# EAGLE design untitled (EAGLE 6.3)
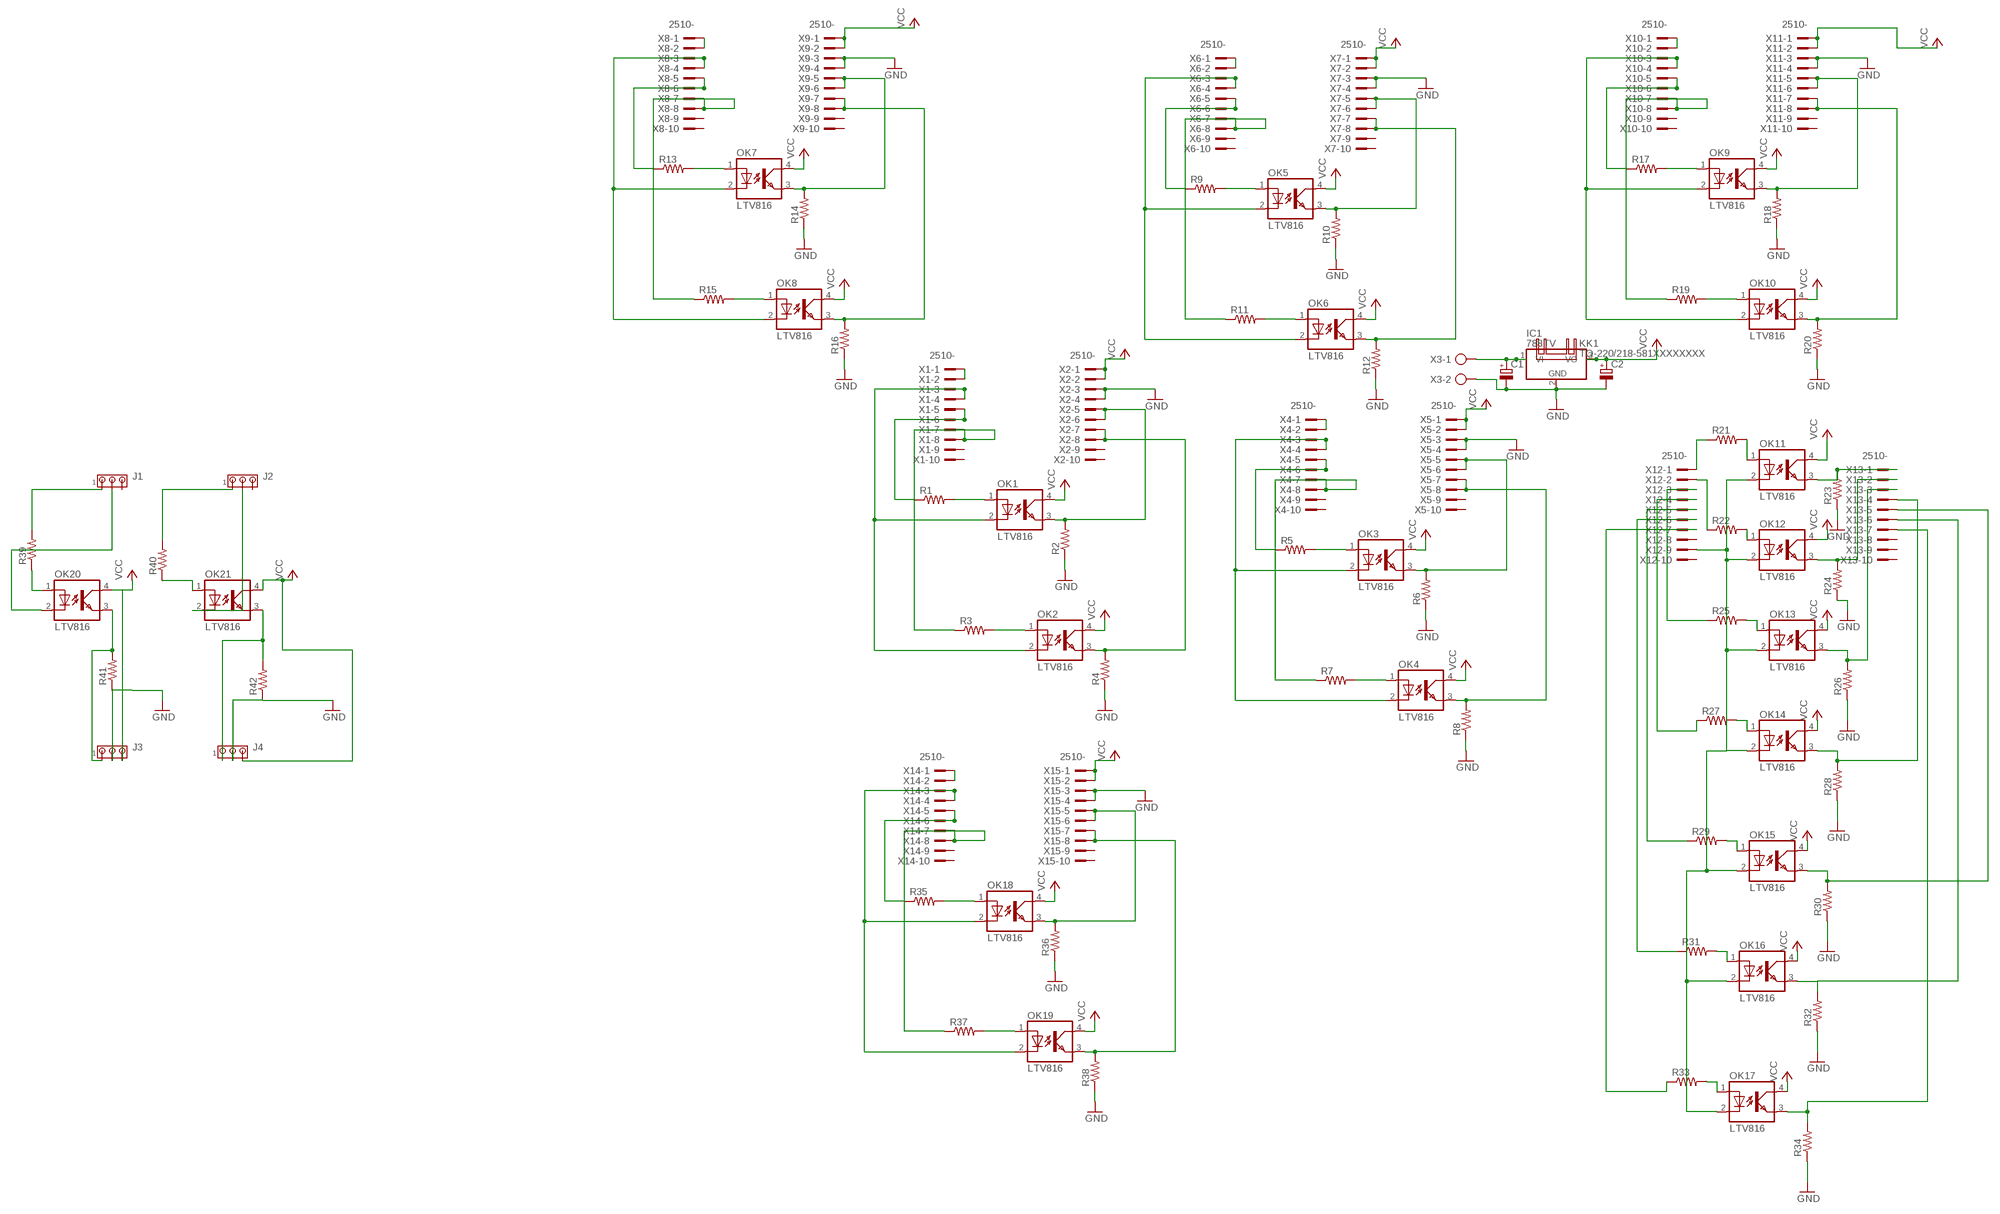
[diagram p0: schematic, sheet 1]

## Parts
C1  CPOL-EUE5-13  [E5-13]
C2  CPOL-EUE5-10.5  [E5-10,5]
IC1  788TV  [TO220V]
J1  MTA03-100  [10X03MTA]
J2  MTA03-100  [10X03MTA]
J3  MTA03-100  [10X03MTA]
J4  MTA03-100  [10X03MTA]
KK1  TO-220/218-581XXXXXXXX  [581XXXXXXXX]
OK1  LTV816  [DIL04]
OK2  LTV816  [DIL04]
OK3  LTV816  [DIL04]
OK4  LTV816  [DIL04]
OK5  LTV816  [DIL04]
OK6  LTV816  [DIL04]
OK7  LTV816  [DIL04]
OK8  LTV816  [DIL04]
OK9  LTV816  [DIL04]
OK10  LTV816  [DIL04]
OK11  LTV816  [DIL04]
OK12  LTV816  [DIL04]
OK13  LTV816  [DIL04]
OK14  LTV816  [DIL04]
OK15  LTV816  [DIL04]
OK16  LTV816  [DIL04]
OK17  LTV816  [DIL04]
OK18  LTV816  [DIL04]
OK19  LTV816  [DIL04]
OK20  LTV816  [DIL04]
OK21  LTV816  [DIL04]
R1  R-US_0207/10  [0207/10]
R2  R-US_0207/10  [0207/10]
R3  R-US_0207/10  [0207/10]
R4  R-US_0207/10  [0207/10]
R5  R-US_0207/10  [0207/10]
R6  R-US_0207/10  [0207/10]
R7  R-US_0207/10  [0207/10]
R8  R-US_0207/10  [0207/10]
R9  R-US_0207/10  [0207/10]
R10  R-US_0207/10  [0207/10]
R11  R-US_0207/10  [0207/10]
R12  R-US_0207/10  [0207/10]
R13  R-US_0207/10  [0207/10]
R14  R-US_0207/10  [0207/10]
R15  R-US_0207/10  [0207/10]
R16  R-US_0207/10  [0207/10]
R17  R-US_0207/10  [0207/10]
R18  R-US_0207/10  [0207/10]
R19  R-US_0207/10  [0207/10]
R20  R-US_0207/10  [0207/10]
R21  R-US_0207/10  [0207/10]
R22  R-US_0207/10  [0207/10]
R23  R-US_0207/10  [0207/10]
R24  R-US_0207/10  [0207/10]
R25  R-US_0207/10  [0207/10]
R26  R-US_0207/10  [0207/10]
R27  R-US_0207/10  [0207/10]
R28  R-US_0207/10  [0207/10]
R29  R-US_0207/10  [0207/10]
R30  R-US_0207/10  [0207/10]
R31  R-US_0207/10  [0207/10]
R32  R-US_0207/10  [0207/10]
R33  R-US_0207/10  [0207/10]
R34  R-US_0207/10  [0207/10]
R35  R-US_0207/10  [0207/10]
R36  R-US_0207/10  [0207/10]
R37  R-US_0207/10  [0207/10]
R38  R-US_0207/10  [0207/10]
R39  R-US_0207/10  [0207/10]
R40  R-US_0207/10  [0207/10]
R41  R-US_0207/10  [0207/10]
R42  R-US_0207/10  [0207/10]
X1  2510-  [PAK100/2500-10]
X2  2510-  [PAK100/2500-10]
X3  AK300/2  [AK300/2]
X4  2510-  [PAK100/2500-10]
X5  2510-  [PAK100/2500-10]
X6  2510-  [PAK100/2500-10]
X7  2510-  [PAK100/2500-10]
X8  2510-  [PAK100/2500-10]
X9  2510-  [PAK100/2500-10]
X10  2510-  [PAK100/2500-10]
X11  2510-  [PAK100/2500-10]
X12  2510-  [PAK100/2500-10]
X13  2510-  [PAK100/2500-10]
X14  2510-  [PAK100/2500-10]
X15  2510-  [PAK100/2500-10]

## Nets
GND: C1.- C2.- IC1.2(GND) J3.2 J4.2 R2.1 R4.1 R6.1 R8.1 R10.1 R12.1 R14.1 R16.1 R18.1 R20.1 R23.1 R24.1 R26.1 R28.1 R30.1 R32.1 R34.1 R36.1 R38.1 R41.1 R42.1 X2.3 X2.4 X3.2 X5.3 X5.4 X7.3 X7.4 X9.3 X9.4 X11.3 X11.4 X15.3 X15.4
N$1: X1.1 X1.2
N$2: X4.1 X4.2
N$3: R1.1 X1.5 X1.6
N$4: R5.1 X4.5 X4.6
N$5: C1.+ IC1.1(VI) X3.1
N$6: OK1.1(A) R1.2
N$7: OK3.1(A) R5.2
N$8: OK3.3(EMIT) R6.2 X5.5 X5.6
N$9: OK3.2(C) OK4.2(C) X4.3 X4.4
N$10: OK1.3(EMIT) R2.2 X2.5 X2.6
N$11: R7.1 X4.7 X4.8
N$12: OK1.2(C) OK2.2(C) X1.3 X1.4
N$13: R3.1 X1.7 X1.8
N$14: OK2.1(A) R3.2
N$15: OK2.3(EMIT) R4.2 X2.7 X2.8
N$16: OK4.1(A) R7.2
N$17: OK4.3(EMIT) R8.2 X5.7 X5.8
N$18: X6.1 X6.2
N$19: R9.1 X6.5 X6.6
N$20: OK5.1(A) R9.2
N$21: OK5.3(EMIT) R10.2 X7.5 X7.6
N$22: OK5.2(C) OK6.2(C) X6.3 X6.4
N$23: R11.1 X6.7 X6.8
N$24: OK6.1(A) R11.2
N$25: OK6.3(EMIT) R12.2 X7.7 X7.8
N$26: X8.1 X8.2
N$27: R13.1 X8.5 X8.6
N$28: OK7.1(A) R13.2
N$29: OK7.3(EMIT) R14.2 X9.5 X9.6
N$30: OK7.2(C) OK8.2(C) X8.3 X8.4
N$31: R15.1 X8.7 X8.8
N$32: OK8.1(A) R15.2
N$33: OK8.3(EMIT) R16.2 X9.7 X9.8
N$34: X10.1 X10.2
N$35: R17.1 X10.5 X10.6
N$36: OK9.1(A) R17.2
N$37: OK9.3(EMIT) R18.2 X11.5 X11.6
N$38: OK9.2(C) OK10.2(C) X10.3 X10.4
N$39: R19.1 X10.7 X10.8
N$40: OK10.1(A) R19.2
N$41: OK10.3(EMIT) R20.2 X11.7 X11.8
N$42: R21.1 X12.1
N$43: OK11.1(A) R21.2
N$44: R22.1 X12.2
N$45: OK12.1(A) R22.2
N$46: R25.1 X12.3
N$47: OK13.1(A) R25.2
N$48: R33.1 X12.7
N$49: OK11.3(EMIT) R23.2 X13.1
N$50: OK12.3(EMIT) R24.2 X13.2
N$51: OK13.3(EMIT) R26.2 X13.3
N$52: OK15.1(A) R29.2
N$53: OK14.1(A) R27.2
N$54: J1.1 R39.2
N$55: OK14.3(EMIT) R28.2 X13.4
N$56: X14.1 X14.2
N$57: OK15.3(EMIT) R30.2 X13.5
N$58: OK16.1(A) R31.2
N$59: OK16.3(EMIT) R32.2 X13.6
N$60: R35.1 X14.5 X14.6
N$61: OK17.1(A) R33.2
N$62: OK11.2(C) OK12.2(C) OK13.2(C) OK14.2(C) OK15.2(C) OK16.2(C) OK17.2(C) X12.9
N$63: OK17.3(EMIT) R34.2 X13.7
N$64: R27.1 X12.4
N$65: R29.1 X12.5
N$66: R31.1 X12.6
N$67: OK18.1(A) R35.2
N$68: OK18.3(EMIT) R36.2 X15.5 X15.6
N$69: OK18.2(C) OK19.2(C) X14.3 X14.4
N$70: R37.1 X14.7 X14.8
N$71: OK19.1(A) R37.2
N$72: OK19.3(EMIT) R38.2 X15.7 X15.8
N$73: OK20.1(A) R39.1
N$74: J1.2 OK20.2(C)
N$75: J3.1 OK20.3(EMIT) R41.2
N$77: J2.1 R40.2
N$78: OK21.1(A) R40.1
N$79: J2.2 OK21.2(C)
N$80: J4.1 OK21.3(EMIT) R42.2
VCC: C2.+ IC1.3(VO) J3.3 J4.3 OK1.4(COL) OK2.4(COL) OK3.4(COL) OK4.4(COL) OK5.4(COL) OK6.4(COL) OK7.4(COL) OK8.4(COL) OK9.4(COL) OK10.4(COL) OK11.4(COL) OK12.4(COL) OK13.4(COL) OK14.4(COL) OK15.4(COL) OK16.4(COL) OK17.4(COL) OK18.4(COL) OK19.4(COL) OK20.4(COL) OK21.4(COL) X2.1 X2.2 X5.1 X5.2 X7.1 X7.2 X9.1 X9.2 X11.1 X11.2 X15.1 X15.2
Unconnected: J1.3 J2.3 X1.9 X1.10 X2.9 X2.10 X4.9 X4.10 X5.9 X5.10 X6.9 X6.10 X7.9 X7.10 X8.9 X8.10 X9.9 X9.10 X10.9 X10.10 X11.9 X11.10 X12.8 X12.10 X13.8 X13.9 X13.10 X14.9 X14.10 X15.9 X15.10

## Library data of the parts
C1 C2 = qfm-trx1-24g:CPOL-EU: POLARIZED CAPACITOR, European symbol
IC1 = linear:78*: Positive VOLTAGE REGULATOR Source: http://cache.national.com/ds/LM/LM78L05.pdf http://www.fairchildsemi.com/ds/LM/LM7805.pdf
J1-J4 = con-amp:MTA03-100: AMP connector
KK1 = heatsink-aavid:TO-220/218: HEATSINKS TO-220/218
OK1-OK21 = optocoupler:LTV816: OPTO COUPLER Source: LITEON, LTV816.pdf; OC_FARNELL: unknown; OC_NEWARK: unknown
R1-R42 = rcl:R-US_: RESISTOR, American symbol
X1 X2 X4-X15 = con-3m:2510-: 3M (TM) Pak 100 4-Wall Header Source: 3M; MF: 3M; MPN: 2510-6002UB; OC_FARNELL: 9838244; OC_NEWARK: 46F4725
X3 = con-ptr500:AK300/2: CONNECTOR; OC_FARNELL: unknown; OC_NEWARK: unknown

## Board
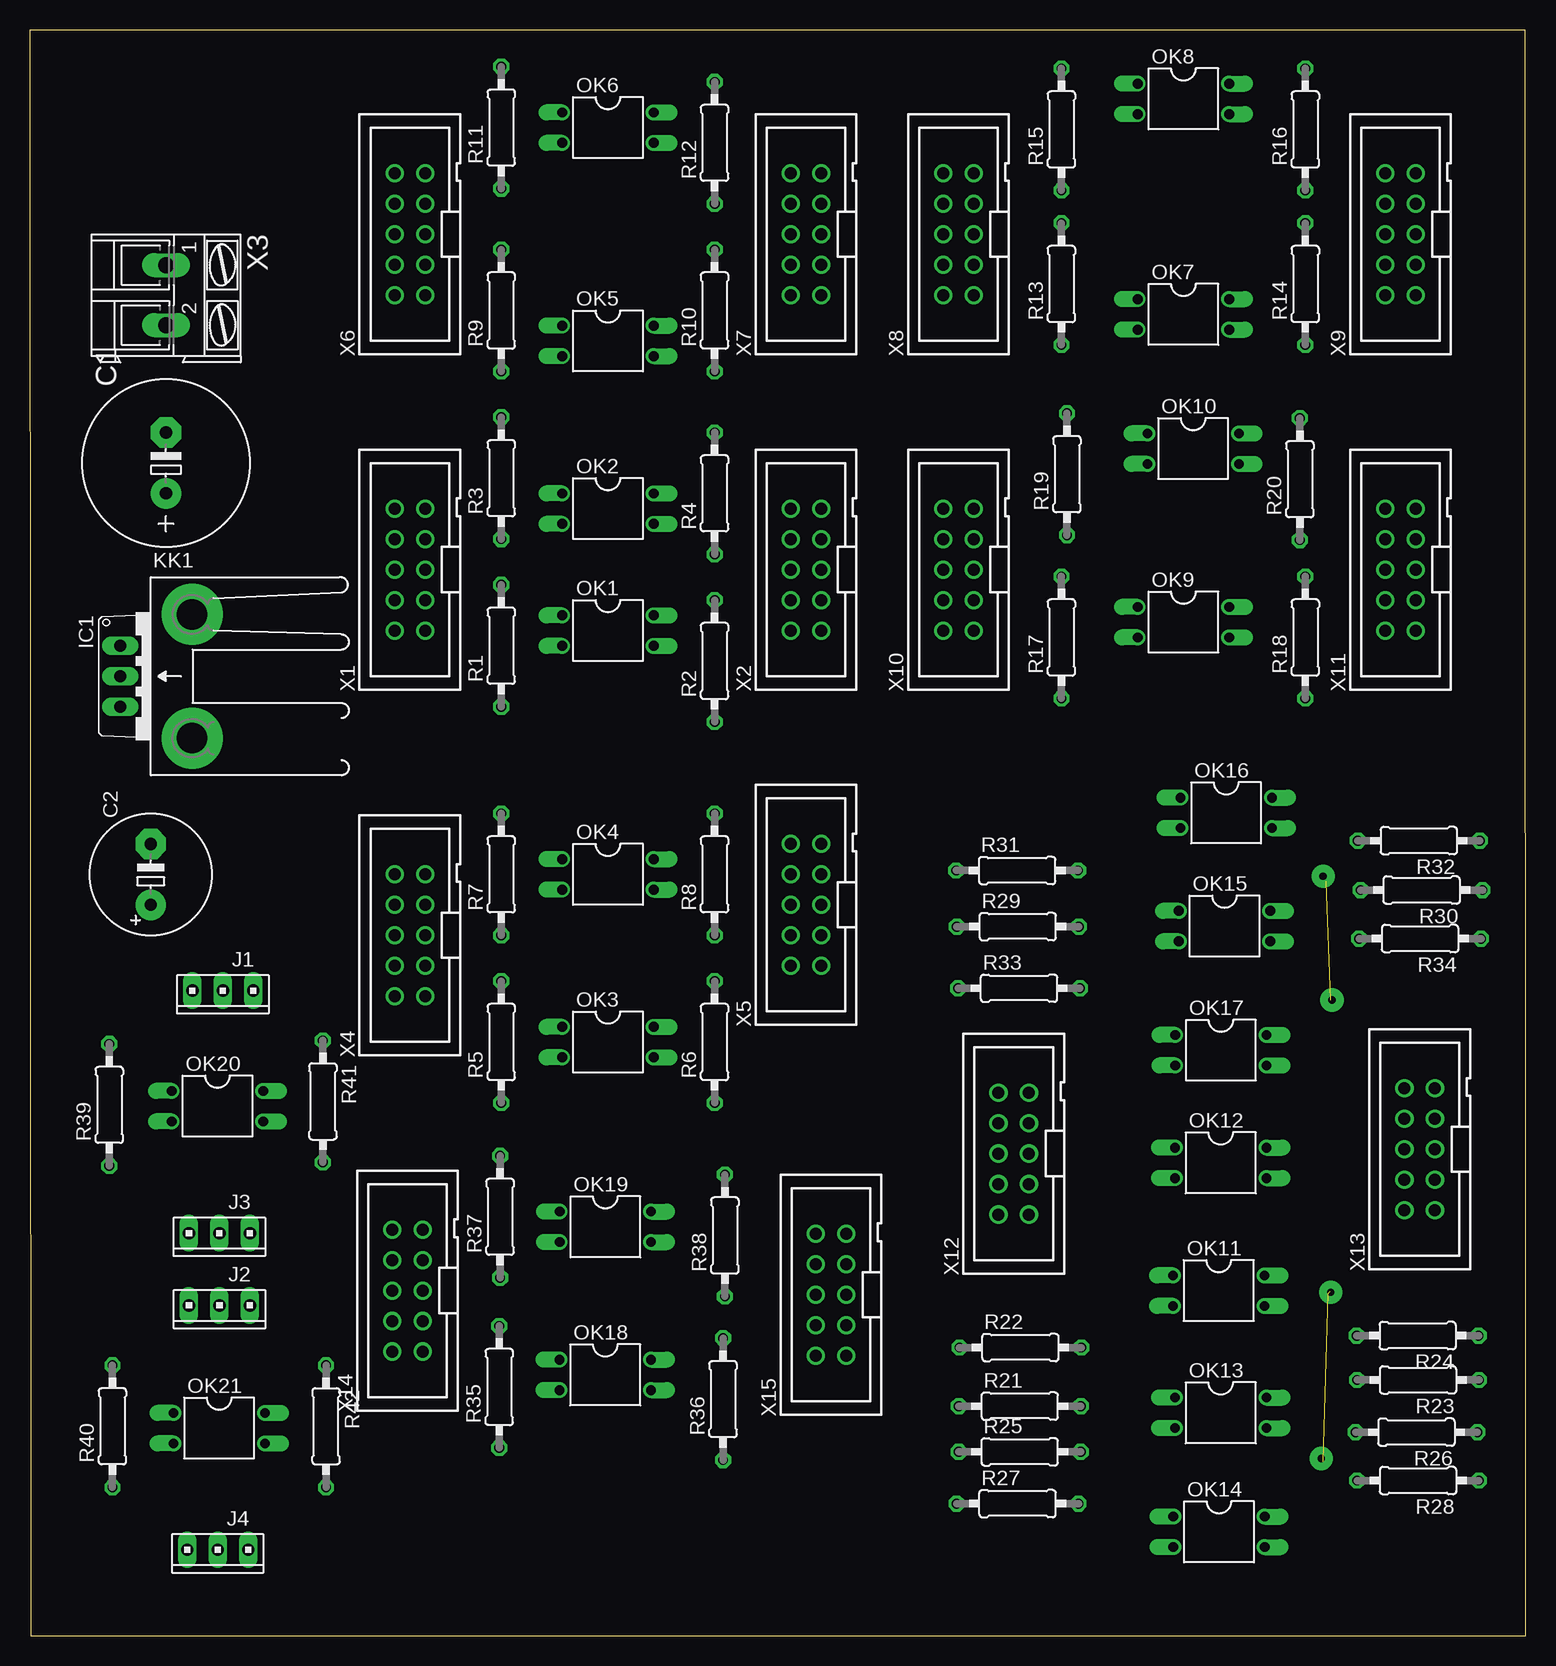
[diagram p1: board, top side]
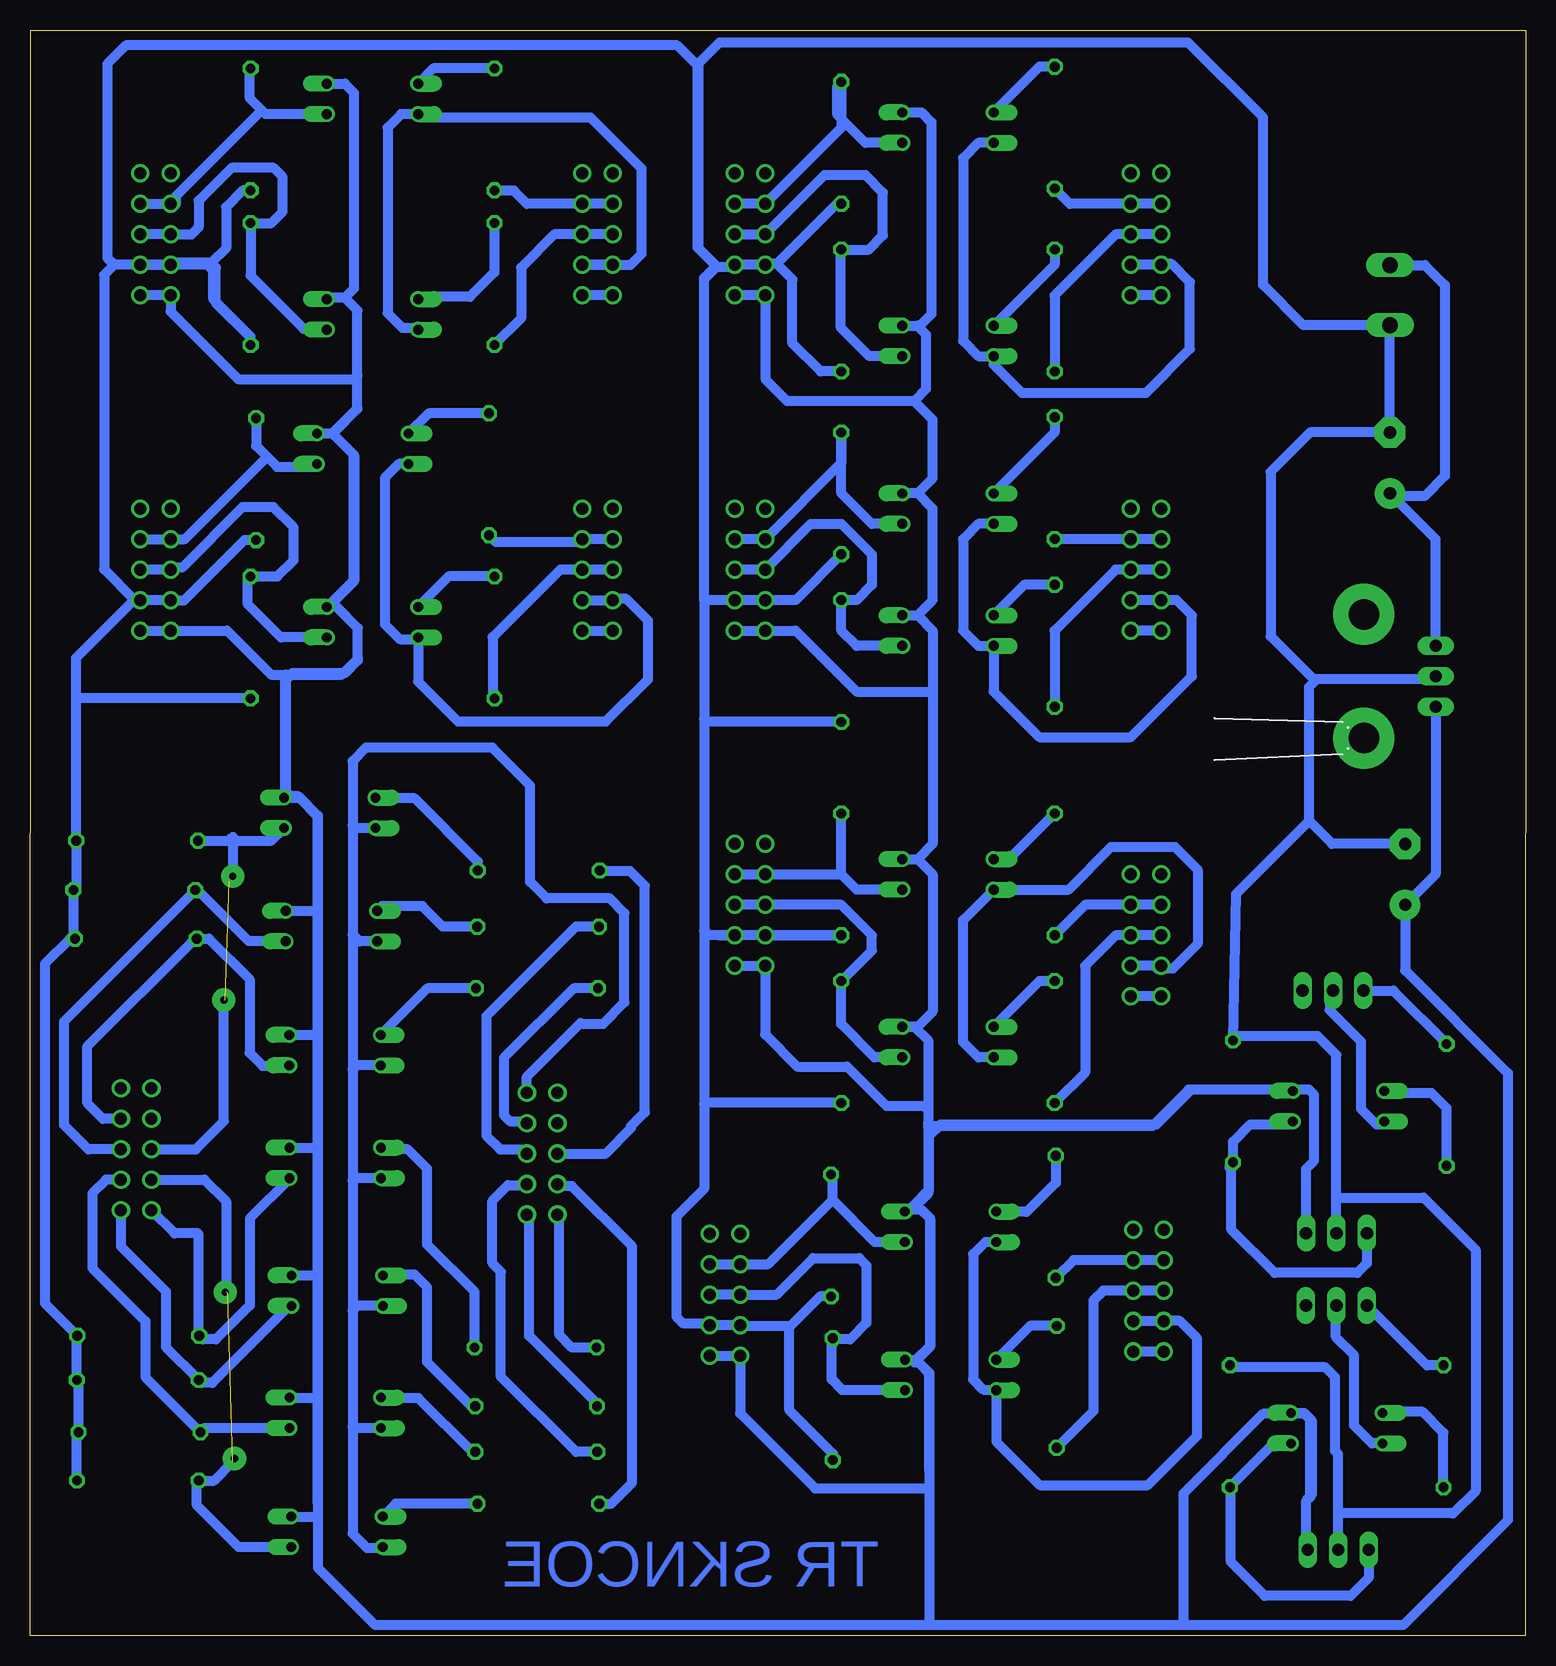
[diagram p2: board, bottom side, seen from below]

Size 124.66 x 133.8 mm. Coordinates in mm from the lower left corner, seen from the top.
Outline: 0.05,0 124.66,0 124.61,133.8 0,133.8 0.05,0
Copper layers (1*16): Top 0.035mm / dielectric 1.5mm / Bottom 0.035mm
Design rules "default": minimum track width 10mil, minimum drill 24mil, track to track 8mil, track to pad 8mil, pad to pad 8mil, via to via 8mil, smd to smd 8mil, copper to edge 40mil, drill to drill 8mil, minimum pad ring 10mil, minimum via ring 8mil, stop-mask expansion 4mil, vias tented up to drill 0mil, thermal gap 10mil

### Footprints (pad centres in the part's own frame; a part is rotated, then mirrored left to right if it is on the bottom)
E5-13 = drill 1.016 pad 2.54: + -2.54,0 | drill 1.016 pad 2.54 octagon: - 2.54,0
E5-10,5 = drill 1.016 pad 2.54: + -2.54,0 | drill 1.016 pad 2.54 octagon: - 2.54,0
TO220V = drill 1.016 long: 1 -2.54,-2.54; 2 0,-2.54; 3 2.54,-2.54
10X03MTA = drill 1.016 long: 1 2.54,0; 2 0,0; 3 -2.54,0
581XXXXXXXX = drill 2.54 pad 5.08: A2,5 -5.16,3.45; B2,5 5.16,3.45
DIL04 = drill 0.813 offset: 1 -1.27,-3.81; 2 1.27,-3.81; 3 1.27,3.81; 4 -1.27,3.81
0207/10 = drill 0.813 octagon: 1 -5.08,0; 2 5.08,0
PAK100/2500-10 = drill 1 pad 1.422: 1 -5.08,-1.27; 2 -5.08,1.27; 3 -2.54,-1.27; 4 -2.54,1.27; 5 0,-1.27; 6 0,1.27; 7 2.54,-1.27; 8 2.54,1.27; 9 5.08,-1.27; 10 5.08,1.27
AK300/2 = drill 1.321 long: 1 -2.515,0; 2 2.489,0

### Placement (x,y rotation side)
C1  11.33,97.72 90 top
C2  10.06,63.43 90 top
IC1  10.06,79.94 270 top
J1  16.08,53.75 180 top
J2  15.79,27.51 180 top
J3  15.79,33.54 180 top
J4  15.65,7.16 180 top
KK1  10.06,79.94 270 top
OK1  48.16,83.75 270 top
OK2  48.16,93.91 270 top
OK3  48.16,49.46 270 top
OK4  48.16,63.43 270 top
OK5  48.16,107.88 270 top
OK6  48.16,125.66 270 top
OK7  96.12,110.09 270 top
OK8  96.12,128.05 270 top
OK9  96.12,84.45 270 top
OK10  96.93,98.91 270 top
OK11  99.06,28.74 270 top
OK12  99.22,39.39 270 top
OK13  99.22,18.56 270 top
OK14  99.08,8.65 270 top
OK15  99.54,59.12 270 top
OK16  99.68,68.56 270 top
OK17  99.24,48.78 270 top
OK18  47.94,21.72 270 top
OK19  47.95,34.06 270 top
OK20  15.62,44.12 270 top
OK21  15.77,17.28 270 top
R1  39.27,82.48 90 top
R2  57.05,81.21 90 top
R3  39.27,96.45 90 top
R4  57.05,95.18 90 top
R5  39.27,49.46 90 top
R6  57.05,49.46 90 top
R7  39.27,63.43 90 top
R8  57.05,63.43 90 top
R9  39.27,110.42 90 top
R10  57.05,110.42 90 top
R11  39.27,125.66 90 top
R12  57.05,124.39 90 top
R13  85.96,112.63 90 top
R14  106.28,112.63 90 top
R15  85.96,125.51 90 top
R16  106.28,125.51 90 top
R17  85.96,83.18 90 top
R18  106.28,83.18 90 top
R19  86.42,96.78 90 top
R20  105.82,96.37 90 top
R21  82.49,19.11 0 top
R22  82.53,24 0 top
R23  115.67,21.3 180 top
R24  115.64,24.99 180 top
R25  82.48,15.31 0 top
R26  115.54,16.95 180 top
R27  82.3,10.99 0 top
R28  115.67,12.92 180 top
R29  82.32,59.08 0 top
R30  115.96,62.12 180 top
R31  82.26,63.76 0 top
R32  115.73,66.24 180 top
R33  82.42,53.94 0 top
R34  115.84,58.08 180 top
R35  39.1,20.72 90 top
R36  57.76,19.7 90 top
R37  39.18,34.9 90 top
R38  57.91,33.34 90 top
R39  6.61,44.22 90 top
R40  6.87,17.44 90 top
R41  24.41,44.51 270 top
R42  24.67,17.44 270 top
X1  31.65,88.83 90 top
X2  64.67,88.83 90 top
X3  11.33,111.69 270 top
X4  31.65,58.35 90 top
X5  64.67,60.89 90 top
X6  31.65,116.77 90 top
X7  64.67,116.77 90 top
X8  77.37,116.77 90 top
X9  114.2,116.77 90 top
X10  77.37,88.83 90 top
X11  114.2,88.83 90 top
X12  81.98,40.17 90 top
X13  115.81,40.52 90 top
X14  31.47,28.75 90 top
X15  66.75,28.41 90 top

### Tracks (layer width: path | path; a pad name or v marks a point on that pad's centre or on a via)
GND
  Bottom 0.813: R2.1 68.25,76.13 68.48,76.36 | 68.48,86.29 68.48,76.36 | 67.21,58.35 X5.3 X5.4 R8.1 68.12,58.35 68.48,58.71 | R4.1 60.86,86.29 X2.4 X2.3 68.48,86.29 | R12.1 57.41,119.31 62.41,114.31 | 62.41,114.31 63.32,114.31 X7.4 X7.3 66.09,114.08 67.44,114.08 | R10.1 58.78,105.34 61.12,107.68 61.12,113.02 62.41,114.31 | 68.48,86.29 68.48,113.04 | 68.48,113.04 67.44,114.08 | 67.44,114.08 68.96,115.6 68.96,131 67.21,132.75 28.15,132.75 21.91,126.51 21.91,112.56 18.55,109.2 X3.2 C1.- 17.98,100.26 21.27,96.98 21.27,83.27 17.72,79.73 17.38,79.73 | X9.3 113.43,114.23 | 113.43,114.23 X9.4 | R16.1 106.93,120.43 108.32,119.03 108.32,115.6 109.54,114.39 | 109.54,114.39 113.27,114.39 113.43,114.23 | 109.54,114.39 109.16,114.01 109.16,111.03 106.28,108.15 R14.1 106.28,108.25 109.38,111.36 109.38,113.72 109.89,114.23 117.65,114.23 | R20.1 106.8,91.29 111.84,86.25 112.89,86.25 X11.4 X11.3 115.5,86.32 115.96,86.32 | 17.38,79.73 7.74,79.73 IC1.2 | C2.- 16.14,65.97 18.06,67.89 | 18.06,67.89 18.06,79.05 17.38,79.73 | 117.65,114.23 118.49,113.38 118.49,88.86 115.96,86.32 | 68.48,113.04 68.48,113.14 67.47,114.15 69.02,115.69 69.02,130.81 70.73,132.52 116.66,132.52 118.21,130.98 118.21,114.79 117.65,114.23 | R38.1 58.82,28.26 61.29,25.8 | 61.29,25.8 65.4,25.8 X15.4 X15.3 68.19,26.04 70.27,26.04 70.81,26.58 70.81,34.9 68.48,37.23 68.48,44.3 | R36.1 57.76,15.16 61.37,18.78 61.37,25.71 61.29,25.8 | 68.48,76.36 68.48,58.71 | 68.48,58.71 68.48,44.3 | R6.1 68.4,44.38 68.48,44.3 | R28.1 120.75,16.81 R26.1 120.62,21.17 R23.1 120.75,24.96 R24.1 | 120.92,25.19 R24.1 | R24.1 123.43,27.7 123.43,55.97 121.31,58.08 R34.1 121.04,58.2 R30.1 120.81,62.35 R32.1 120.81,78.33
  Bottom 0.813: 18.06,67.89 24.15,61.8 R41.1 24.05,49.95 17.36,49.95 15.79,48.38 J3.2 15.79,36.45 15.75,36.49 8.52,36.49 4.2,32.17 4.2,12.04 6.06,10.17 15.57,10.17 15.65,10.25 | J4.2 15.65,10.25 | 15.65,10.25 15.65,15.13 15.91,15.39 15.91,21.54 16.7,22.34 24.49,22.34 R42.1 | 120.81,78.33 120.81,81.47 115.96,86.32 | R18.1 120.58,78.1 120.81,78.33
N$1
  Bottom 0.813: X1.2 X1.1
N$2
  Bottom 0.813: X4.2 X4.1
N$3
  Bottom 0.813: X1.6 X1.5 34.19,88.83 39.27,83.75 R1.1
N$4
  Bottom 0.813: X4.6 X4.5 34.19,58.35 36.73,55.81 36.73,46.92 R5.1
N$5
  Bottom 0.813: X3.1 8.42,114.21 6.75,112.54 6.75,96.64 8.44,94.95 11.1,94.95 C1.+ 7.52,91.37 IC1.1
N$6
  Bottom 0.813: R1.2 41.81,87.56 OK1.1
N$7
  Bottom 0.813: R5.2 40.54,54.54 OK3.1
N$8
  Bottom 0.813: X5.5 X5.6 57.05,60.89 54.51,58.35 54.51,57.08 R6.2 57.07,54.52 57.07,50.96 54.3,48.19 OK3.3
N$9
  Bottom 0.813: X4.4 30.97,55.81 | 30.97,55.81 X4.3 | OK3.2 45.62,48.19 46.89,49.46 46.89,59.62 OK4.2 38.12,62.16 34.57,65.71 29.26,65.71 27.37,63.82 27.37,57.64 29.42,55.58 30.74,55.58 30.97,55.81
N$10
  Bottom 0.813: OK1.3 55.78,82.48 57.05,83.75 R2.2 55.78,86.29 54.51,87.56 54.51,90.1 57.05,92.64 59.59,92.64 X2.6 X2.5
N$11
  Bottom 0.813: X4.8 X4.7 36.73,60.89 R7.1
N$12
  Bottom 0.813: X1.3 X1.4 29.11,86.29 27.84,85.02 27.84,79.94 32.92,74.86 40.54,74.86 44.35,78.67 OK1.2 45.62,82.48 46.89,83.75 46.89,91.37 45.62,92.64 OK2.2
N$13
  Bottom 0.813: X1.8 X1.7 R3.1
N$14
  Bottom 0.813: R3.2 39.27,100.26 OK2.1
N$15
  Bottom 0.813: OK2.3 54.51,92.64 57.05,95.18 R4.2 57.05,97.72 X2.8 X2.7
N$16
  Bottom 0.813: OK4.1 43.08,64.7 R7.2
N$17
  Bottom 0.813: X5.7 X5.8 57.05,63.43 | OK4.3 55.78,62.16 57.05,63.43 | 57.05,63.43 R8.2
N$18
  Bottom 0.813: X6.2 X6.1
N$19
  Bottom 0.813: X6.6 X6.5 34.19,116.77 39.27,111.69 R9.1
N$20
  Bottom 0.813: R9.2 39.27,114.23 OK5.1
N$21
  Bottom 0.813: X7.5 X7.6 58.47,121.7 55.03,121.7 53.58,120.25 53.58,116.67 54.75,115.5 R10.2 57.08,115.47 57.08,108.98 54.72,106.61 OK5.3
N$22
  Bottom 0.813: X6.3 X6.4 30.3,114.31 29.52,114.31 28,112.79 28,107.22 31.66,103.57 42.01,103.57 44.35,105.91 OK5.2 45.62,106.61 46.89,107.88 46.89,123.12 45.62,124.39 OK6.2
N$23
  Bottom 0.813: X6.8 X6.7 38,119.31 R11.1
N$24
  Bottom 0.813: R11.2 40.54,130.74 OK6.1
N$25
  Bottom 0.813: X7.7 X7.8 57.05,125.66 R12.2 57.39,129.13 57.39,126.73 55.05,124.39 OK6.3
N$26
  Bottom 0.813: X8.2 X8.1
N$27
  Bottom 0.813: X8.6 X8.5 80.97,116.77 83.73,114 83.73,109.78 R13.1
N$28
  Bottom 0.813: R13.2 85.96,113.6 88,111.57 92.1,111.57 OK7.1
N$29
  Bottom 0.813: X9.5 X9.6 112.91,116.75 111.22,116.75 110.61,117.36 110.61,119.57 107.87,122.31 104.37,122.31 103.6,121.55 103.6,118.65 104.55,117.71 R14.2 106.28,113.32 101.85,108.9 100.01,108.9 OK7.3
N$30
  Bottom 0.813: OK7.2 92.46,108.98 93.63,108.98 94.85,110.19 94.85,125.66 93.73,126.78 OK8.2 92.03,126.5 77.95,126.5 73.68,122.24 73.68,115.15 74.6,114.23 X8.3 X8.4
N$31
  Bottom 0.813: X8.8 X8.7 83.25,119.31 84.34,120.41 85.93,120.41 R15.1
N$32
  Bottom 0.813: R15.2 91.04,130.59 OK8.1
N$33
  Bottom 0.813: OK8.3 105.02,126.78 105.35,127.11 | 105.35,127.11 106.35,128.1 106.35,130.52 R16.2 | X9.7 X9.8 112.49,119.31 112.49,119.98 105.35,127.11
N$34
  Bottom 0.813: X10.1 X10.2
N$35
  Bottom 0.813: X10.6 X10.5 80.46,88.83 86.1,83.19 86.1,78.24 R17.1
N$36
  Bottom 0.813: R17.2 89.77,88.26 OK9.1
N$37
  Bottom 0.813: OK9.3 103.74,83.18 106.51,85.94 106.51,88.02 R18.2 104.05,88.26 102.7,89.6 102.7,92.35 104.38,94.03 106.96,94.03 111.99,88.99 112.77,88.99 X11.6 X11.5
N$38
  Bottom 0.813: X10.3 X10.4 76,86.4 74.98,86.4 73.16,84.57 73.16,79.68 76.67,76.17 89,76.17 92.31,79.49 OK9.2 92.44,83.04 93.87,83.04 95.09,84.26 95.09,96.47 93.92,97.64 OK10.2
N$39
  Bottom 0.813: X10.8 78.55,91.37 78.64,91.28 | R19.1 85.85,91.13 78.79,91.13 78.64,91.28 | X10.7 78.64,91.28
N$40
  Bottom 0.813: R19.2 91.44,101.86 OK10.1
N$41
  Bottom 0.813: R20.2 105.82,99.13 104.91,98.22 | 104.91,98.22 104.07,97.38 100.99,97.38 OK10.3 | X11.7 X11.8 111.76,91.37 104.91,98.22
N$42
  Bottom 0.813: R21.1 77.4,19.31 83.06,24.97 83.06,34.9 X12.1
N$43
  Bottom 0.813: R21.2 87.9,19.12 91.56,22.78 91.56,29.02 92.62,30.07 95.19,30.07 OK11.1
N$44
  Bottom 0.813: R22.1 79.51,24 80.55,25.05 80.55,34.93 X12.2
N$45
  Bottom 0.813: R22.2 87.61,28.63 91.56,32.58 91.56,38.9 93.18,40.52 95.28,40.52 OK12.1
N$46
  Bottom 0.813: R25.1 79.16,15.31 85.41,21.57 85.41,30.32 86.14,31.05 86.14,36.23 84.84,37.53 83.87,37.53 83.79,37.61 83.27,37.61 X12.3
N$47
  Bottom 0.813: R25.2 87.82,15.31 92.29,19.78 95.37,19.78 OK13.1
N$48
  Bottom 0.813: R33.1 79.37,53.94 85.17,48.14 85.17,43.36 84.68,42.87 83.41,42.87 X12.7
N$49
  Bottom 0.813: OK11.3 103.06,27.47 109.47,21.06 110.35,21.06 R23.2 113.33,24.04 113.33,28.68 117.08,32.43 X13.1
N$50
  Bottom 0.813: X13.2 112.61,33.52 110.65,33.52 110.65,25.09 R24.2 110.25,24.69 109.18,24.69 106.34,27.52 106.34,34.76 103.03,38.07 OK12.3
N$51
  Bottom 0.813: X13.3 118.32,37.98 119.45,36.85 119.45,30.62 115.05,26.21 115.05,21.54 R26.2 110.12,17.29 OK13.3
N$52
  Bottom 0.813: R29.2 90.27,59.08 91.97,60.78 95.34,60.78 OK15.1
N$53
  Bottom 0.813: R27.2 94.2,10.99 OK14.1
N$54
  Bottom 0.813: J1.1 11.05,53.75 R39.2
N$55  (3 unrouted)
  Bottom 0.813: OK14.3 107.28,7.38 110.76,10.85 110.76,12.75 R28.2 109.31,12.92 107.76,14.47 | X13.4 110.13,37.98 108.32,36.18 108.32,28.66
N$56
  Bottom 0.813: X14.2 X14.1
N$57
  Bottom 0.813: OK15.3 103.4,57.9 106.46,57.9 110.69,62.12 R30.2 121.82,51.19 121.82,42.54 119.8,40.52 X13.5
N$58
  Bottom 0.813: R31.2 87.34,64.5 92.62,69.77 95.82,69.77 OK16.1
N$59  (1 unrouted)
  Bottom 0.813: OK16.3 104.54,66.24 R32.2 108.06,66.24 107.76,66.55 107.76,63.14 108.04,62.86 | X13.6 110.84,40.52 108.5,42.86 108.5,52.85 108.39,52.96
N$60
  Bottom 0.813: X14.6 X14.5 35.23,28.75 36.05,27.94 36.05,18.69 R35.1
N$61
  Bottom 0.813: R33.2 91.54,53.94 OK17.1
N$62
  Bottom 0.813: X12.9 83.25,46.58 | 83.25,46.58 78.77,51.06 | 83.25,46.58 | 83.25,46.58 78.85,50.98 76.91,50.98 75.13,52.76 75.13,60.21 76.34,61.43 81.6,61.43 82.98,62.8 82.98,70.83 86.14,73.98 96.67,73.98 97.78,72.86 97.78,67.57 | 97.78,67.57 97.78,58.44 | 97.78,58.44 97.78,47.16 | 97.78,47.16 97.78,37.92 | 97.78,37.92 97.78,27.07 | 97.78,27.07 97.78,17.41 | 97.78,17.41 97.78,8.5 96.58,7.31 95.34,7.31 OK14.2 | OK13.2 97.66,17.29 97.78,17.41 | OK11.2 97.38,27.47 97.78,27.07 | OK12.2 97.58,38.12 97.78,37.92 | OK17.2 97.43,47.51 97.78,47.16 | OK15.2 97.2,57.85 97.78,58.44 | OK16.2 97.5,67.29 97.78,67.57
N$63
  Bottom 0.813: 103.18,47.37 OK17.3 103.08,47.48 103.67,47.48 103.78,47.37 103.89,47.37 103.99,47.48 105.28,47.48 106.35,48.55 106.35,54.68 109.76,58.08 R34.2 111.04,57.79 111.19,57.79 119.88,49.1 119.88,44.37 118.58,43.06 X13.7
N$64
  Bottom 0.813: R27.1 76.22,10.99 74.48,12.73 74.48,32.43 79.5,37.45 80.52,37.45 X12.4
N$65
  Bottom 0.813: R29.1 79.17,59.08 86.63,51.62 86.63,41.66 85.49,40.52 83.6,40.52 X12.5
N$66
  Bottom 0.813: X12.6 76.7,40.17 74.56,42.31 74.56,42.47 73.43,43.6 73.43,62.48 74.64,63.7 77.12,63.7 R31.1
N$67
  Bottom 0.813: R35.2 41.32,25.8 OK18.1
N$68
  Bottom 0.813: X15.5 X15.6 62.44,28.41 59.41,31.44 55.56,31.44 54.96,30.85 54.96,26.05 56.33,24.68 57.66,24.68 R36.2 57.78,24.76 57.78,24.25 57.87,24.17 57.87,21.34 56.97,20.45 OK18.3
N$69
  Bottom 0.813: X14.3 X14.4 28.86,26.22 27.41,24.77 27.41,16.64 31.52,12.53 40.5,12.53 44.13,16.16 OK18.2 44.17,20.49 45.2,20.49 46.06,21.34 46.06,31.79 45.05,32.79 OK19.2
N$70
  Bottom 0.813: X14.8 X14.7 37.7,31.29 R37.1
N$71
  Bottom 0.813: R37.2 39.18,37.73 41.61,35.3 44.1,35.3 OK19.1
N$72
  Bottom 0.813: X15.7 X15.8 63.15,30.95 57.78,36.32 | OK19.3 54.25,32.79 57.78,36.32 | 57.78,36.32 57.78,38.29 R38.2
N$73
  Bottom 0.813: R39.1 6.61,43.95 7.86,45.2 11.62,45.2 OK20.1
N$74
  Bottom 0.813: J1.2 16.35,53.48 16.35,52.11 13.76,49.52 13.76,43.9 12.46,42.61 12.05,42.61 OK20.2
N$75
  Bottom 0.813: OK20.3 19.67,42.61 22.97,42.61 24.41,41.17 R41.2 24.7,39.14 24.7,39.01 24.55,38.86 24.55,33.82 20.95,30.22 14.05,30.22 13.25,31.02 J3.1
N$76  (via drill 0.6 pad 1.93)
  other vias: 108.5,52.96
N$77
  Bottom 0.813: R40.2 8.25,22.52 J2.1
N$78
  Bottom 0.813: R40.1 6.87,16.92 8.6,18.65 11.21,18.65 11.28,18.58 11.93,18.58 OK21.1
N$79
  Bottom 0.813: OK21.2 12.83,16.01 14.32,17.49 14.32,23.35 15.84,24.87 15.84,27.46 J2.2
N$80
  Bottom 0.813: OK21.3 21.02,16.01 R42.2 24.59,12.27 24.59,6.13 21.77,3.31 14.61,3.31 13.11,4.81 J4.1
N$81  (via drill 0.6 pad 1.93)
  other vias: 107.76,63.28
N$82  (via drill 0.6 pad 1.93)
  other vias: 107.62,14.75
N$83  (via drill 0.6 pad 1.93)
  other vias: 108.39,28.6
VCC
  Bottom 0.813: 50.7,95.18 49.43,96.45 49.43,101.32 50.99,102.88 | 50.7,95.18 OK2.4 | 50.7,85.02 49.43,86.29 49.43,93.91 50.7,95.18 | X2.1 X2.2 60.86,83.75 55.78,78.67 49.43,78.67 | OK1.4 50.7,85.02 | 50.7,85.02 49.43,83.75 49.43,78.67 | OK4.4 50.7,64.7 | 50.7,64.7 49.43,63.43 49.43,52 50.7,50.73 OK3.4 50.96,50.73 49.82,49.59 49.82,43.76 | X5.1 X5.2 63.4,50.09 60.73,47.42 56.57,47.42 53.3,44.15 50.21,44.15 49.82,43.76 | 49.43,78.67 49.43,65.97 50.7,64.7 | OK6.4 50.36,126.93 49.55,126.12 49.55,110.12 50.54,109.13 51.95,109.13 OK5.4 50.71,109.15 50,108.44 50,103.87 50.99,102.88 | X7.1 X7.2 63.33,111.62 63.33,104.63 61.58,102.88 50.99,102.88 | X9.1 X9.2 112.93,110.33 107.31,104.71 97.66,104.71 97.37,105 | OK8.4 98.43,129.32 97.67,128.56 97.67,112.25 98.43,111.49 | 98.43,111.49 99.8,111.49 OK7.4 | X11.1 X11.2 108.23,83.75 104.56,80.08 103.35,80.08 | OK10.4 99.46,100.18 | 99.46,100.18 97.37,102.27 | 97.37,102.27 97.37,105 | 97.37,105 97.37,110.44 98.43,111.49 | OK9.4 99.88,85.72 99.51,86.09 | 99.51,86.09 97.68,87.92 97.68,98.39 99.46,100.18 | 97.52,84.11 99.51,86.09 | IC1.3 7.52,63.43 C2.+ 10.06,55.44 1.5,46.88 1.5,9.61 10.23,0.88 28.43,0.88 | 97.37,102.27 97.37,102.22 99.36,100.23 99.36,100.06 97.64,98.35 97.64,87.87 99.7,85.81 99.19,85.81 97.34,83.96 97.34,81.42 | OK18.4 50.83,22.99 | 50.83,22.99 49.65,24.17 49.65,34.78 50.34,35.47 51.19,35.47 | 51.19,35.47 51.62,35.47 OK19.4 | X15.1 X15.2 65.48,18.51 59.23,12.27 50.05,12.27 49.71,11.92 | 49.74,13.81 49.74,21.9 50.83,22.99 | 49.82,43.76 49.82,42.7 | 49.82,42.7 49.82,42.41 | 49.82,42.41 49.82,36.84 51.19,35.47 | 100.66,10.96 100.66,19.98 | 100.66,19.98 100.66,29.76
  Bottom 0.813: 100.66,29.76 100.66,40.93 | 100.66,40.93 100.66,49.84 | 100.66,49.84 100.66,60.37 | 100.66,60.37 100.66,68.32 102.27,69.93 103.39,69.93 | 103.39,69.93 OK16.4 | OK15.4 101.22,60.39 101.2,60.37 100.66,60.37 | OK17.4 100.87,50.05 100.66,49.84 | OK12.4 100.93,40.66 100.66,40.93 | OK13.4 100.82,19.83 100.66,19.98 | OK11.4 100.92,30.01 100.66,29.76 | 103.39,69.93 103.39,80.04 103.35,80.08 | 103.35,80.08 98.67,80.08 97.34,81.42 | 97.34,81.42 97.34,81.26 98.4,80.19 102.8,80.19 103.36,79.63 103.36,70.38 102.8,69.81 102.23,69.81 100.67,68.25 100.67,9.79 | 100.67,9.79 100.67,5.67 95.88,0.88 49.71,0.88 | OK14.4 100.8,9.92 100.67,9.79 | J3.3 18.33,38.9 17.64,39.58 17.64,45.06 18.08,45.49 19.33,45.49 | 19.33,45.49 OK20.4 | OK21.4 18.48,18.55 17.86,17.93 17.86,11.7 18.29,11.27 18.29,11.26 | 18.29,6.64 18.29,7.05 | 18.29,7.05 J4.3 | 49.75,42.34 49.82,42.41 | 28.43,0.88 49.71,0.88 | 18.29,7.05 18.29,11.26 | 18.29,11.26 17.98,11.58 17.98,17.97 18.47,18.47 21.91,18.47 28.56,11.83 28.56,1 28.43,0.88 | 27.89,45.49 28.1,45.49 31.14,42.45 49.58,42.45 49.82,42.7 | 19.33,45.49 27.89,45.49 | 27.89,45.49 30.8,42.58 48.77,42.58 49.76,41.59 49.76,37.15 51.23,35.67 50.59,35.67 49.64,34.73 49.64,24.07 50.93,22.77 50.61,22.77 49.71,21.87 49.71,11.92 | 49.71,11.92 49.71,0.88

### Text on the board
Bottom: TR SKNCOE